# Altium schematic sheet 反馈模块.SchDoc
size A4
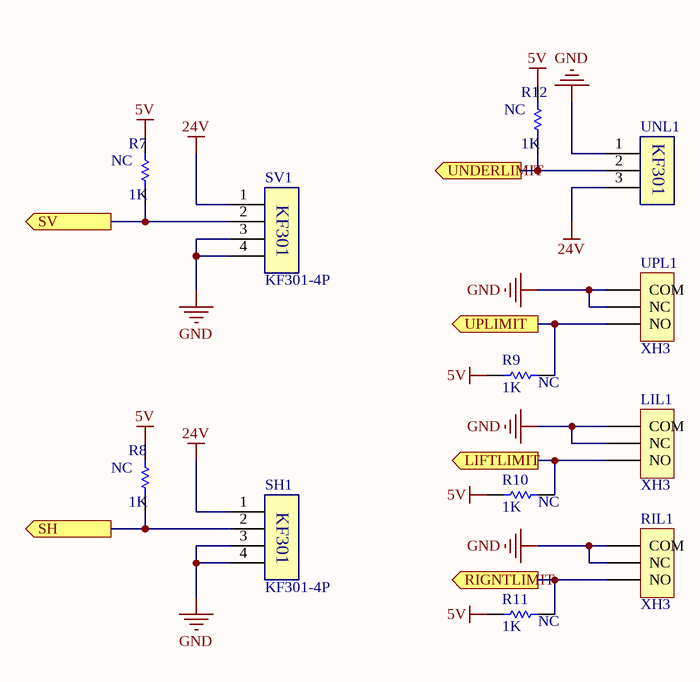
[diagram p0: 反馈模块.SchDoc]

## Parts
LIL1  XH3  [XH3/2.54mm/180]
R7  value 1K  NOTE: NC  [0603R]  (hidden comment: RES)
R8  value 1K  NOTE: NC  [0603R]  (hidden comment: RES)
R9  value 1K  NOTE: NC  [0603R]  (hidden comment: RES)
R10  value 1K  NOTE: NC  [0603R]  (hidden comment: RES)
R11  value 1K  NOTE: NC  [0603R]  (hidden comment: RES)
R12  value 1K  NOTE: NC  [0603R]  (hidden comment: RES)
RIL1  XH3  [XH3/2.54mm/180]
SH1  KF301-4P  [KF301-5.0-4P]
SV1  KF301-4P  [KF301-5.0-4P]
UNL1  KF301-3P  [KF301-5.0-3P]  (value not drawn)
UPL1  XH3  [XH3/2.54mm/180]

## Ports
LIFTLIMIT (out), RIGNTLIMIT (out), SH (out), SV (out), UNDERLIMIT (out), UPLIMIT (out)

## Nets
5V: R7.2 R8.2 R9.2 R10.2 R11.2 R12.2
24V: SH1.1 SV1.1 UNL1.3(VCC)
GND: LIL1.1(COM) LIL1.2(NC) RIL1.1(COM) RIL1.2(NC) SH1.3 SH1.4 SV1.3 SV1.4 UNL1.1(GND) UPL1.1(COM) UPL1.2(NC)
LIFTLIMIT: LIL1.3(NO) R10.1 ; port LIFTLIMIT
RIGNTLIMIT: R11.1 RIL1.3(NO) ; port RIGNTLIMIT
SH: R8.1 SH1.2 ; port SH
SV: R7.1 SV1.2 ; port SV
UNDERLIMIT: R12.1 UNL1.2(VIN) ; port UNDERLIMIT
UPLIMIT: R9.1 UPL1.3(NO) ; port UPLIMIT

## Notes on the sheet
- (in symbol KF301-3P) KF301
- (in symbol KF301-4P) KF301

## Library data of the parts
R7-R12 = RES: note: note